# Altium schematic sheet BackBoard.SchDoc
size A1
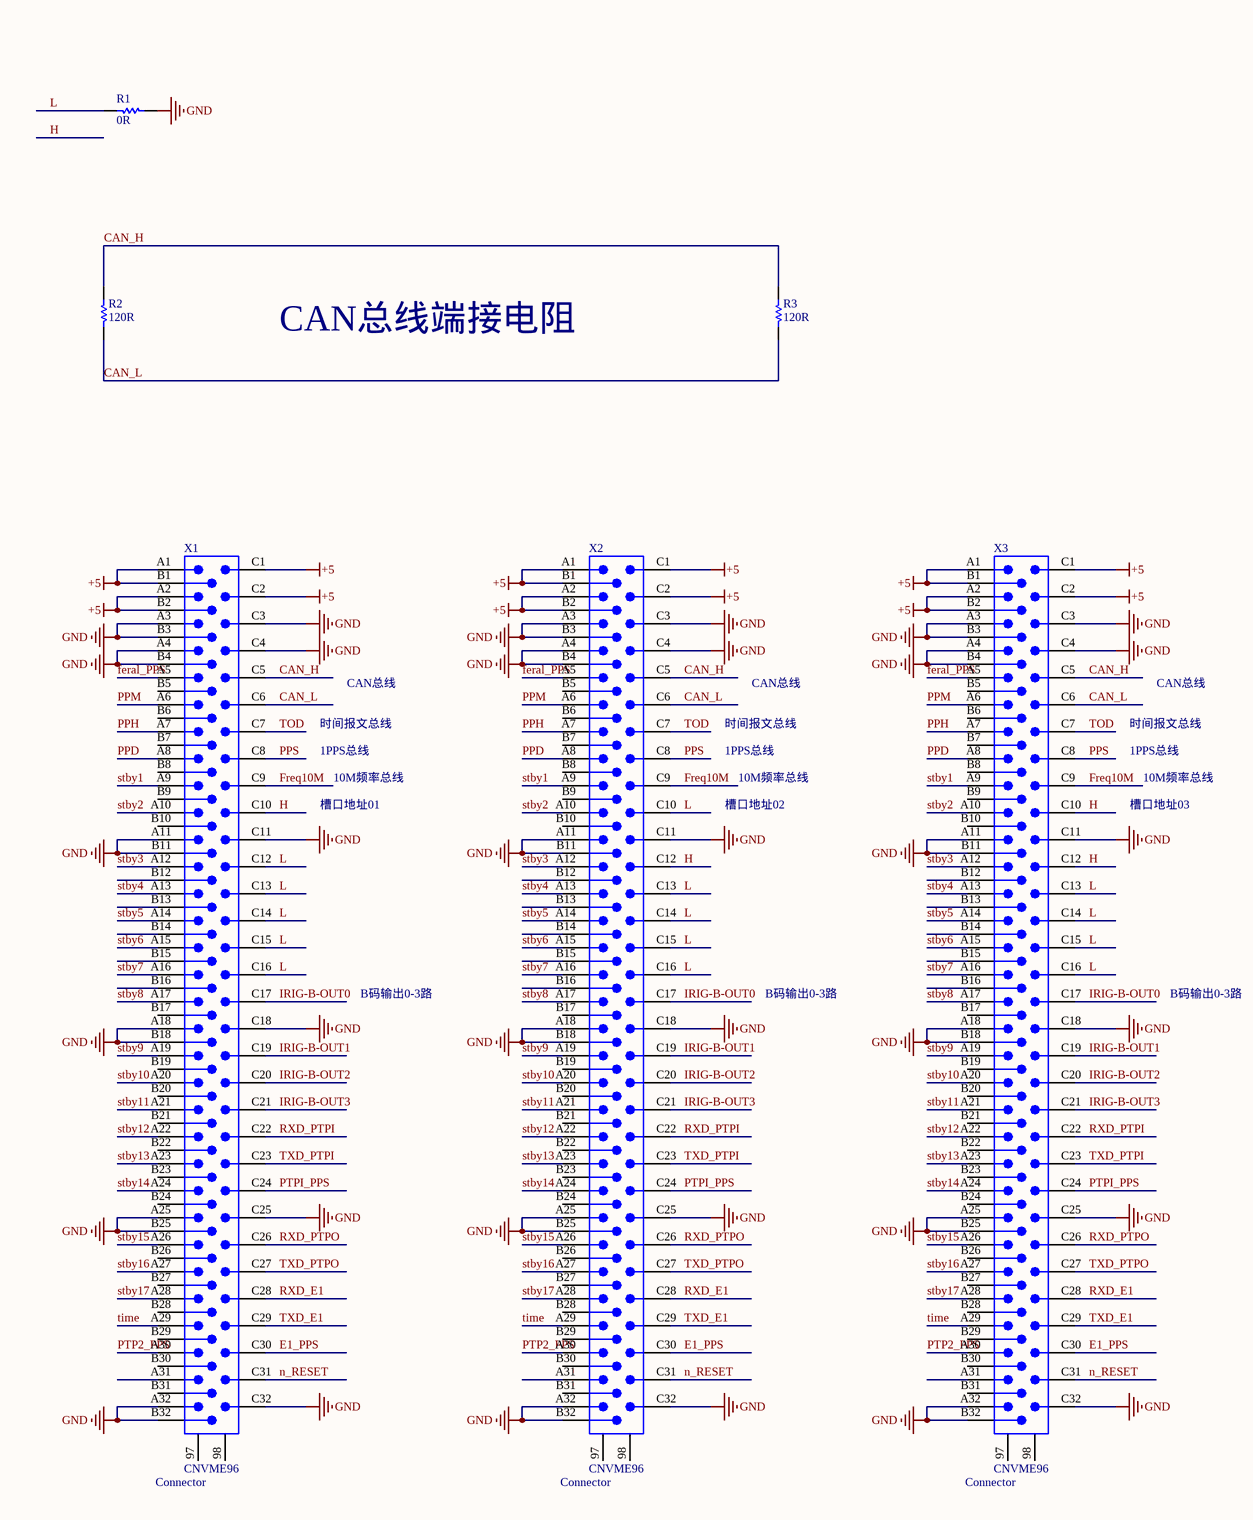
[diagram p0: BackBoard.SchDoc, top left]
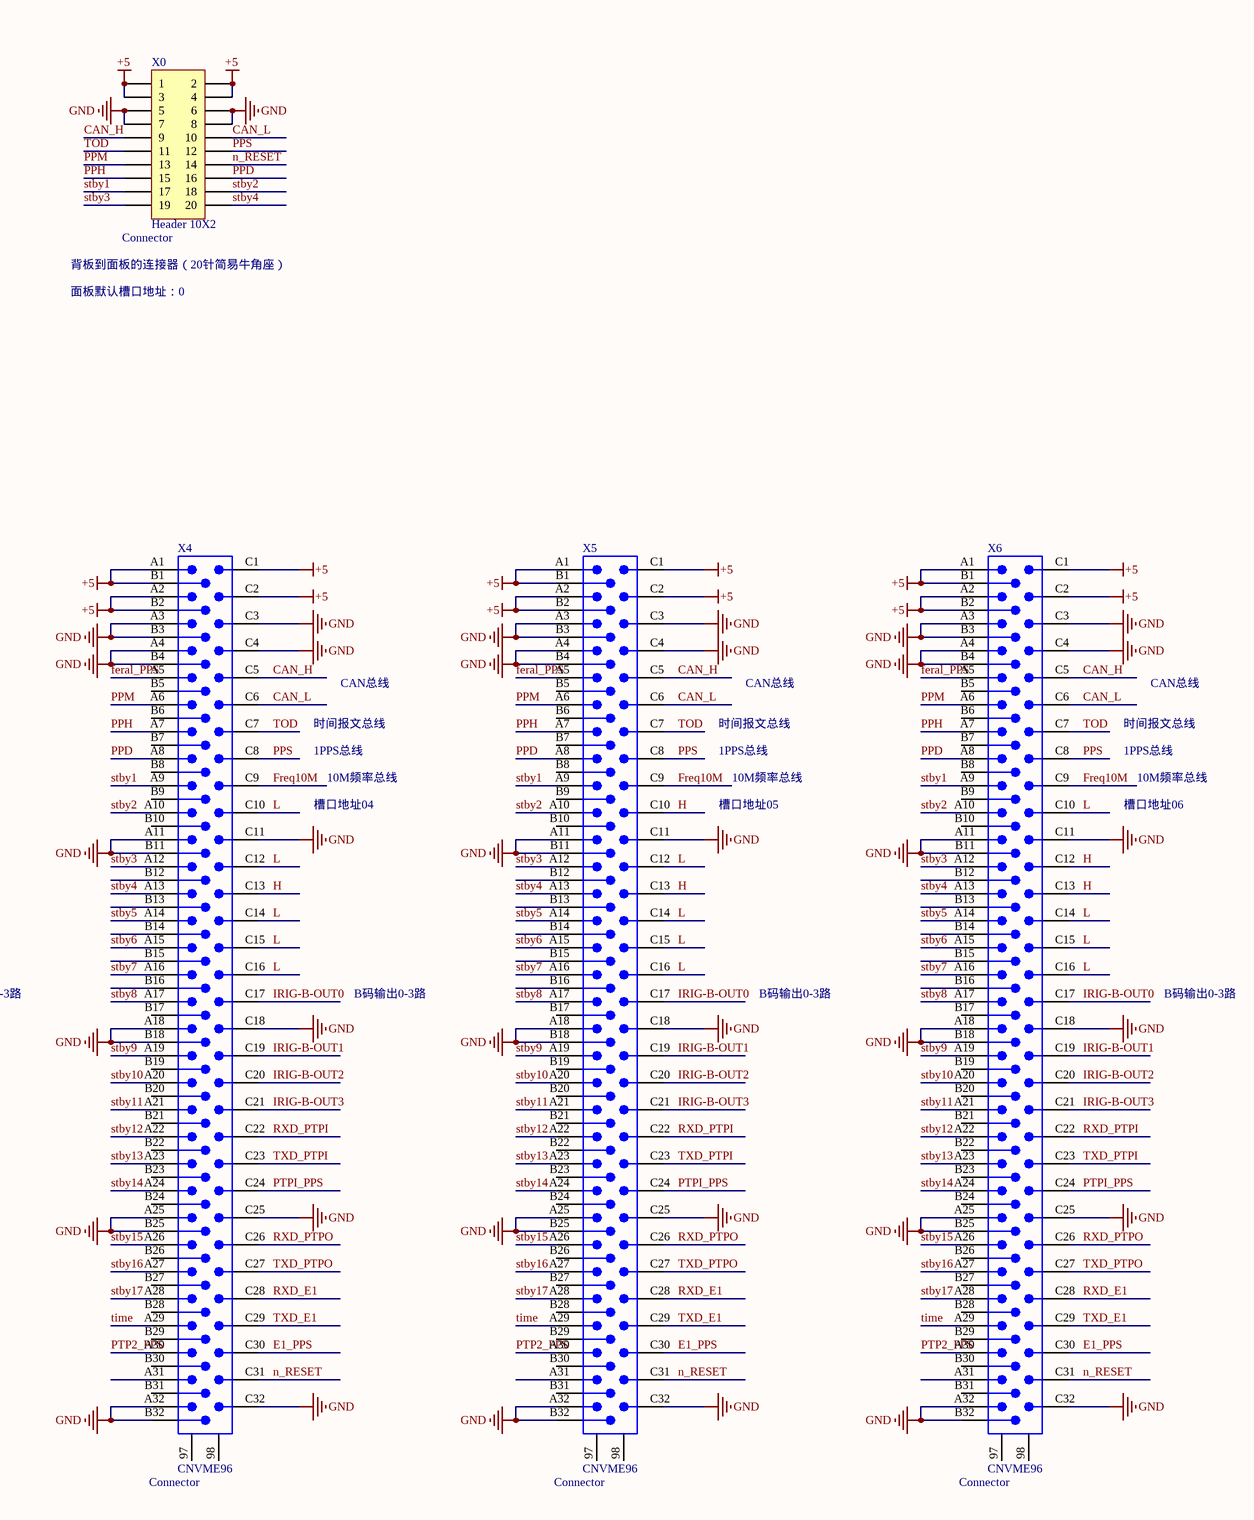
[diagram p1: BackBoard.SchDoc, top right]
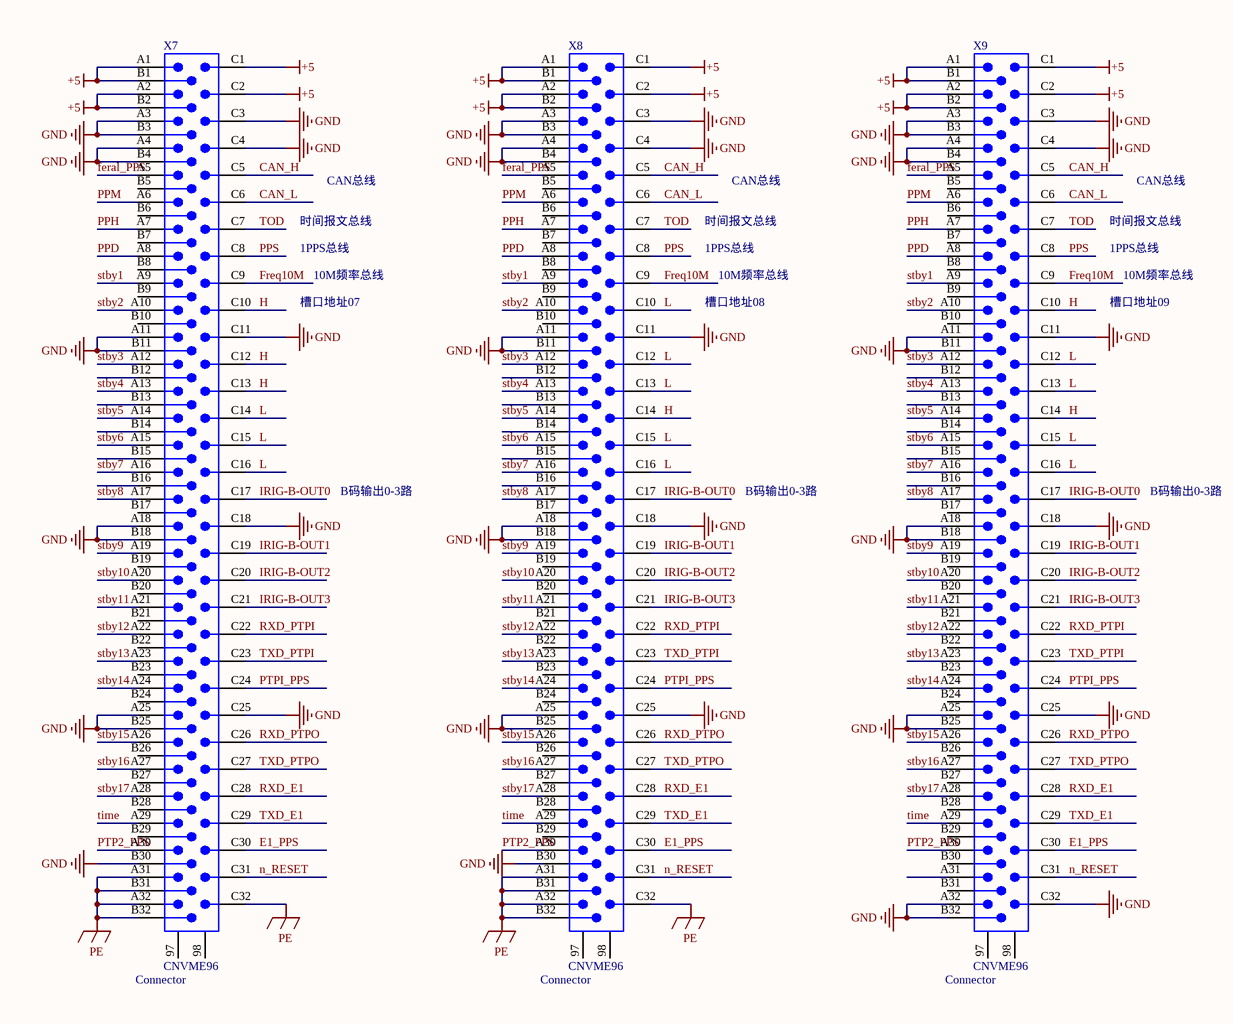
[diagram p2: BackBoard.SchDoc, bottom left]
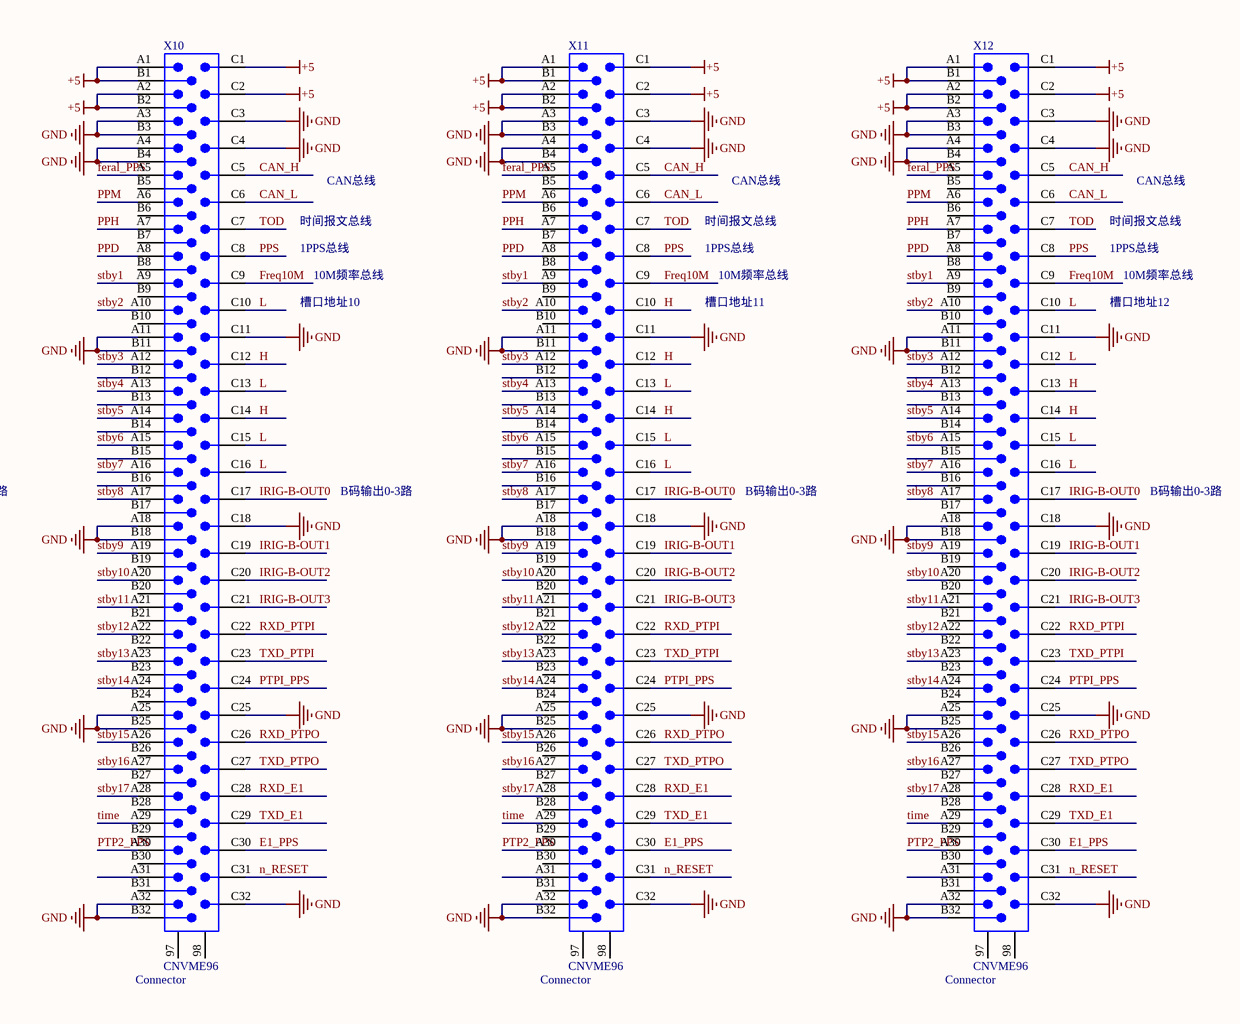
[diagram p3: BackBoard.SchDoc, bottom right]

## Parts
R1  value 0R  [0603_XF]  (hidden comment: Res1)
R2  value 120R  [0603_XF]  (hidden comment: Res1)
R3  value 120R  [0603_XF]  (hidden comment: Res1)
X0  Header 10X2  System: Connector  [HDR2X10]
X1  CNVME96  System: Connector  [CONNECT_96_Female]
X2  CNVME96  System: Connector  [CONNECT_96_Female]
X3  CNVME96  System: Connector  [CONNECT_96_Female]
X4  CNVME96  System: Connector  [CONNECT_96_Female]
X5  CNVME96  System: Connector  [CONNECT_96_Female]
X6  CNVME96  System: Connector  [CONNECT_96_Female]
X7  CNVME96  System: Connector  [CONNECT_96_Female]
X8  CNVME96  System: Connector  [CONNECT_96_Female]
X9  CNVME96  System: Connector  [CONNECT_96_Female]
X10  CNVME96  System: Connector  [CONNECT_96_Female]
X11  CNVME96  System: Connector  [CONNECT_96_Female]
X12  CNVME96  System: Connector  [CONNECT_96_Female]

## Nets
+5: X0.1 X0.2 X0.3 X0.4 X1.A1 X1.A2 X1.B1 X1.B2 X1.C1 X1.C2 X2.A1 X2.A2 X2.B1 X2.B2 X2.C1 X2.C2 X3.A1 X3.A2 X3.B1 X3.B2 X3.C1 X3.C2 X4.A1 X4.A2 X4.B1 X4.B2 X4.C1 X4.C2 X5.A1 X5.A2 X5.B1 X5.B2 X5.C1 X5.C2 X6.A1 X6.A2 X6.B1 X6.B2 X6.C1 X6.C2 X7.A1 X7.A2 X7.B1 X7.B2 X7.C1 X7.C2 X8.A1 X8.A2 X8.B1 X8.B2 X8.C1 X8.C2 X9.A1 X9.A2 X9.B1 X9.B2 X9.C1 X9.C2 X10.A1 X10.A2 X10.B1 X10.B2 X10.C1 X10.C2 X11.A1 X11.A2 X11.B1 X11.B2 X11.C1 X11.C2 X12.A1 X12.A2 X12.B1 X12.B2 X12.C1 X12.C2
GND: R1.2 X0.5 X0.6 X0.7 X0.8 X1.A3 X1.A4 X1.A11 X1.A18 X1.A25 X1.A32 X1.B3 X1.B4 X1.B11 X1.B18 X1.B25 X1.B32 X1.C3 X1.C4 X1.C11 X1.C18 X1.C25 X1.C32 X2.A3 X2.A4 X2.A11 X2.A18 X2.A25 X2.A32 X2.B3 X2.B4 X2.B11 X2.B18 X2.B25 X2.B32 X2.C3 X2.C4 X2.C11 X2.C18 X2.C25 X2.C32 X3.A3 X3.A4 X3.A11 X3.A18 X3.A25 X3.A32 X3.B3 X3.B4 X3.B11 X3.B18 X3.B25 X3.B32 X3.C3 X3.C4 X3.C11 X3.C18 X3.C25 X3.C32 X4.A3 X4.A4 X4.A11 X4.A18 X4.A25 X4.A32 X4.B3 X4.B4 X4.B11 X4.B18 X4.B25 X4.B32 X4.C3 X4.C4 X4.C11 X4.C18 X4.C25 X4.C32 X5.A3 X5.A4 X5.A11 X5.A18 X5.A25 X5.A32 X5.B3 X5.B4 X5.B11 X5.B18 X5.B25 X5.B32 X5.C3 X5.C4 X5.C11 X5.C18 X5.C25 X5.C32 X6.A3 X6.A4 X6.A11 X6.A18 X6.A25 X6.A32 X6.B3 X6.B4 X6.B11 X6.B18 X6.B25 X6.B32 X6.C3 X6.C4 X6.C11 X6.C18 X6.C25 X6.C32 X7.A3 X7.A4 X7.A11 X7.A18 X7.A25 X7.B3 X7.B4 X7.B11 X7.B18 X7.B25 X7.B30 X7.C3 X7.C4 X7.C11 X7.C18 X7.C25 X8.A3 X8.A4 X8.A11 X8.A18 X8.A25 X8.B3 X8.B4 X8.B11 X8.B18 X8.B25 X8.B30 X8.C3 X8.C4 X8.C11 X8.C18 X8.C25 X9.A3 X9.A4 X9.A11 X9.A18 X9.A25 X9.A32 X9.B3 X9.B4 X9.B11 X9.B18 X9.B25 X9.B32 X9.C3 X9.C4 X9.C11 X9.C18 X9.C25 X9.C32 X10.A3 X10.A4 X10.A11 X10.A18 X10.A25 X10.A32 X10.B3 X10.B4 X10.B11 X10.B18 X10.B25 X10.B32 X10.C3 X10.C4 X10.C11 X10.C18 X10.C25 X10.C32 X11.A3 X11.A4 X11.A11 X11.A18 X11.A25 X11.A32 X11.B3 X11.B4 X11.B11 X11.B18 X11.B25 X11.B32 X11.C3 X11.C4 X11.C11 X11.C18 X11.C25 X11.C32 X12.A3 X12.A4 X12.A11 X12.A18 X12.A25 X12.A32 X12.B3 X12.B4 X12.B11 X12.B18 X12.B25 X12.B32 X12.C3 X12.C4 X12.C11 X12.C18 X12.C25 X12.C32
PE: X7.A31 X7.A32 X7.B31 X7.B32 X7.C32 X8.A31 X8.A32 X8.B31 X8.B32 X8.C32
CAN_H: R2.1 R3.2 X0.9 X1.C5 X2.C5 X3.C5 X4.C5 X5.C5 X6.C5 X7.C5 X8.C5 X9.C5 X10.C5 X11.C5 X12.C5
CAN_L: R2.2 R3.1 X0.10 X1.C6 X2.C6 X3.C6 X4.C6 X5.C6 X6.C6 X7.C6 X8.C6 X9.C6 X10.C6 X11.C6 X12.C6
E1_PPS: X1.C30 X2.C30 X3.C30 X4.C30 X5.C30 X6.C30 X7.C30 X8.C30 X9.C30 X10.C30 X11.C30 X12.C30
feral_PPS: X1.A5 X2.A5 X3.A5 X4.A5 X5.A5 X6.A5 X7.A5 X8.A5 X9.A5 X10.A5 X11.A5 X12.A5
Freq10M: X1.C9 X2.C9 X3.C9 X4.C9 X5.C9 X6.C9 X7.C9 X8.C9 X9.C9 X10.C9 X11.C9 X12.C9
H: X1.C10 X2.C12 X3.C10 X3.C12 X4.C13 X5.C10 X5.C13 X6.C12 X6.C13 X7.C10 X7.C12 X7.C13 X8.C14 X9.C10 X9.C14 X10.C12 X10.C14 X11.C10 X11.C12 X11.C14 X12.C13 X12.C14
IRIG-B-OUT0: X1.C17 X2.C17 X3.C17 X4.C17 X5.C17 X6.C17 X7.C17 X8.C17 X9.C17 X10.C17 X11.C17 X12.C17
IRIG-B-OUT1: X1.C19 X2.C19 X3.C19 X4.C19 X5.C19 X6.C19 X7.C19 X8.C19 X9.C19 X10.C19 X11.C19 X12.C19
IRIG-B-OUT2: X1.C20 X2.C20 X3.C20 X4.C20 X5.C20 X6.C20 X7.C20 X8.C20 X9.C20 X10.C20 X11.C20 X12.C20
IRIG-B-OUT3: X1.C21 X2.C21 X3.C21 X4.C21 X5.C21 X6.C21 X7.C21 X8.C21 X9.C21 X10.C21 X11.C21 X12.C21
L: R1.1 X1.C12 X1.C13 X1.C14 X1.C15 X1.C16 X2.C10 X2.C13 X2.C14 X2.C15 X2.C16 X3.C13 X3.C14 X3.C15 X3.C16 X4.C10 X4.C12 X4.C14 X4.C15 X4.C16 X5.C12 X5.C14 X5.C15 X5.C16 X6.C10 X6.C14 X6.C15 X6.C16 X7.C14 X7.C15 X7.C16 X8.C10 X8.C12 X8.C13 X8.C15 X8.C16 X9.C12 X9.C13 X9.C15 X9.C16 X10.C10 X10.C13 X10.C15 X10.C16 X11.C13 X11.C15 X11.C16 X12.C10 X12.C12 X12.C15 X12.C16
n_RESET: X0.14 X1.C31 X2.C31 X3.C31 X4.C31 X5.C31 X6.C31 X7.C31 X8.C31 X9.C31 X10.C31 X11.C31 X12.C31
PPD: X0.16 X1.A8 X2.A8 X3.A8 X4.A8 X5.A8 X6.A8 X7.A8 X8.A8 X9.A8 X10.A8 X11.A8 X12.A8
PPH: X0.15 X1.A7 X2.A7 X3.A7 X4.A7 X5.A7 X6.A7 X7.A7 X8.A7 X9.A7 X10.A7 X11.A7 X12.A7
PPM: X0.13 X1.A6 X2.A6 X3.A6 X4.A6 X5.A6 X6.A6 X7.A6 X8.A6 X9.A6 X10.A6 X11.A6 X12.A6
PPS: X0.12 X1.C8 X2.C8 X3.C8 X4.C8 X5.C8 X6.C8 X7.C8 X8.C8 X9.C8 X10.C8 X11.C8 X12.C8
PTP2_PPS: X1.A30 X2.A30 X3.A30 X4.A30 X5.A30 X6.A30 X7.A30 X8.A30 X9.A30 X10.A30 X11.A30 X12.A30
PTPI_PPS: X1.C24 X2.C24 X3.C24 X4.C24 X5.C24 X6.C24 X7.C24 X8.C24 X9.C24 X10.C24 X11.C24 X12.C24
RXD_E1: X1.C28 X2.C28 X3.C28 X4.C28 X5.C28 X6.C28 X7.C28 X8.C28 X9.C28 X10.C28 X11.C28 X12.C28
RXD_PTPI: X1.C22 X2.C22 X3.C22 X4.C22 X5.C22 X6.C22 X7.C22 X8.C22 X9.C22 X10.C22 X11.C22 X12.C22
RXD_PTPO: X1.C26 X2.C26 X3.C26 X4.C26 X5.C26 X6.C26 X7.C26 X8.C26 X9.C26 X10.C26 X11.C26 X12.C26
stby1: X0.17 X1.A9 X2.A9 X3.A9 X4.A9 X5.A9 X6.A9 X7.A9 X8.A9 X9.A9 X10.A9 X11.A9 X12.A9
stby2: X0.18 X1.A10 X2.A10 X3.A10 X4.A10 X5.A10 X6.A10 X7.A10 X8.A10 X9.A10 X10.A10 X11.A10 X12.A10
stby3: X0.19 X1.A12 X2.A12 X3.A12 X4.A12 X5.A12 X6.A12 X7.A12 X8.A12 X9.A12 X10.A12 X11.A12 X12.A12
stby4: X0.20 X1.A13 X2.A13 X3.A13 X4.A13 X5.A13 X6.A13 X7.A13 X8.A13 X9.A13 X10.A13 X11.A13 X12.A13
stby5: X1.A14 X2.A14 X3.A14 X4.A14 X5.A14 X6.A14 X7.A14 X8.A14 X9.A14 X10.A14 X11.A14 X12.A14
stby6: X1.A15 X2.A15 X3.A15 X4.A15 X5.A15 X6.A15 X7.A15 X8.A15 X9.A15 X10.A15 X11.A15 X12.A15
stby7: X1.A16 X2.A16 X3.A16 X4.A16 X5.A16 X6.A16 X7.A16 X8.A16 X9.A16 X10.A16 X11.A16 X12.A16
stby8: X1.A17 X2.A17 X3.A17 X4.A17 X5.A17 X6.A17 X7.A17 X8.A17 X9.A17 X10.A17 X11.A17 X12.A17
stby9: X1.A19 X2.A19 X3.A19 X4.A19 X5.A19 X6.A19 X7.A19 X8.A19 X9.A19 X10.A19 X11.A19 X12.A19
stby10: X1.A20 X2.A20 X3.A20 X4.A20 X5.A20 X6.A20 X7.A20 X8.A20 X9.A20 X10.A20 X11.A20 X12.A20
stby11: X1.A21 X2.A21 X3.A21 X4.A21 X5.A21 X6.A21 X7.A21 X8.A21 X9.A21 X10.A21 X11.A21 X12.A21
stby12: X1.A22 X2.A22 X3.A22 X4.A22 X5.A22 X6.A22 X7.A22 X8.A22 X9.A22 X10.A22 X11.A22 X12.A22
stby13: X1.A23 X2.A23 X3.A23 X4.A23 X5.A23 X6.A23 X7.A23 X8.A23 X9.A23 X10.A23 X11.A23 X12.A23
stby14: X1.A24 X2.A24 X3.A24 X4.A24 X5.A24 X6.A24 X7.A24 X8.A24 X9.A24 X10.A24 X11.A24 X12.A24
stby15: X1.A26 X2.A26 X3.A26 X4.A26 X5.A26 X6.A26 X7.A26 X8.A26 X9.A26 X10.A26 X11.A26 X12.A26
stby16: X1.A27 X2.A27 X3.A27 X4.A27 X5.A27 X6.A27 X7.A27 X8.A27 X9.A27 X10.A27 X11.A27 X12.A27
stby17: X1.A28 X2.A28 X3.A28 X4.A28 X5.A28 X6.A28 X7.A28 X8.A28 X9.A28 X10.A28 X11.A28 X12.A28
time: X1.A29 X2.A29 X3.A29 X4.A29 X5.A29 X6.A29 X7.A29 X8.A29 X9.A29 X10.A29 X11.A29 X12.A29
TOD: X0.11 X1.C7 X2.C7 X3.C7 X4.C7 X5.C7 X6.C7 X7.C7 X8.C7 X9.C7 X10.C7 X11.C7 X12.C7
TXD_E1: X1.C29 X2.C29 X3.C29 X4.C29 X5.C29 X6.C29 X7.C29 X8.C29 X9.C29 X10.C29 X11.C29 X12.C29
TXD_PTPI: X1.C23 X2.C23 X3.C23 X4.C23 X5.C23 X6.C23 X7.C23 X8.C23 X9.C23 X10.C23 X11.C23 X12.C23
TXD_PTPO: X1.C27 X2.C27 X3.C27 X4.C27 X5.C27 X6.C27 X7.C27 X8.C27 X9.C27 X10.C27 X11.C27 X12.C27

Not connected (* = marked no-connect by the designer): X1 97 98 A31 B5 B6 B7 B8 B9 B10 B12 B13 B14 B15 B16 B17 B19 B20 B21 B22 B23 B24 B26 B27 B28 B29 B30 B31; X2 97 98 A31 B5 B6 B7 B8 B9 B10 B12 B13 B14 B15 B16 B17 B19 B20 B21 B22 B23 B24 B26 B27 B28 B29 B30 B31; X3 97 98 A31 B5 B6 B7 B8 B9 B10 B12 B13 B14 B15 B16 B17 B19 B20 B21 B22 B23 B24 B26 B27 B28 B29 B30 B31; X4 97 98 A31 B5 B6 B7 B8 B9 B10 B12 B13 B14 B15 B16 B17 B19 B20 B21 B22 B23 B24 B26 B27 B28 B29 B30 B31; X5 97 98 A31 B5 B6 B7 B8 B9 B10 B12 B13 B14 B15 B16 B17 B19 B20 B21 B22 B23 B24 B26 B27 B28 B29 B30 B31; X6 97 98 A31 B5 B6 B7 B8 B9 B10 B12 B13 B14 B15 B16 B17 B19 B20 B21 B22 B23 B24 B26 B27 B28 B29 B30 B31; X7 97 98 B5 B6 B7 B8 B9 B10 B12 B13 B14 B15 B16 B17 B19 B20 B21 B22 B23 B24 B26 B27 B28 B29; X8 97 98 B5 B6 B7 B8 B9 B10 B12 B13 B14 B15 B16 B17 B19 B20 B21 B22 B23 B24 B26 B27 B28 B29; X9 97 98 A31 B5 B6 B7 B8 B9 B10 B12 B13 B14 B15 B16 B17 B19 B20 B21 B22 B23 B24 B26 B27 B28 B29 B30 B31; X10 97 98 A31 B5 B6 B7 B8 B9 B10 B12 B13 B14 B15 B16 B17 B19 B20 B21 B22 B23 B24 B26 B27 B28 B29 B30 B31; X11 97 98 A31 B5 B6 B7 B8 B9 B10 B12 B13 B14 B15 B16 B17 B19 B20 B21 B22 B23 B24 B26 B27 B28 B29 B30 B31; X12 97 98 A31 B5 B6 B7 B8 B9 B10 B12 B13 B14 B15 B16 B17 B19 B20 B21 B22 B23 B24 B26 B27 B28 B29 B30 B31

## Notes on the sheet
- 背板到面板的连接器（20针简易牛角座）
- CAN总线端接电阻
- 面板默认槽口地址：0
- 时间报文总线
- CAN总线
- 1PPS总线
- 槽口地址01
- 10M频率总线
- 槽口地址02
- 槽口地址03
- 槽口地址04
- 槽口地址05
- 槽口地址06
- B码输出0-3路
- 槽口地址07
- 槽口地址08
- 槽口地址09
- 槽口地址10
- 槽口地址11
- 槽口地址12
- Title
- Size:
- Date:
- File:
- A1
- Number:
- Time:
- Revision:
- Sheet
- of

## Library data of the parts
R1-R3 = Res1: Resistor; Published: 8-Jun-2000; LatestRevisionDate: 17-Jul-2002; LatestRevisionNote: Re-released for DXP Platform.; PackageReference: AXIAL-0.3; Publisher: Altium Limited; PackageDescription: Axial Device, Thru-Hole; 2 Leads; 0.3 in Pin Spacing
X0 = Header 10X2: Header, 10-Pin, Dual row; LatestRevisionDate: 17-Jul-2002; LatestRevisionNote: Re-released for DXP Platform.; Publisher: Altium Limited
X1-X12 = CNVME96: 96-Pin Connector (3x32 2.54mm grid); Text Field6: Alternate Layout Available; Text Field7: Published 14-Feb-2002; Value: DIN41612-C-96-F